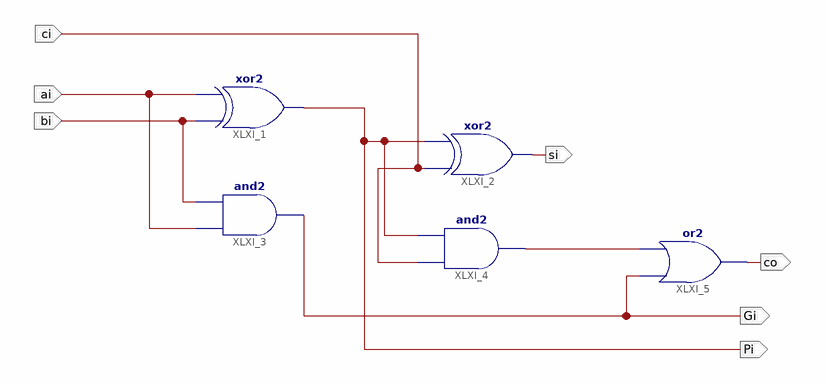
[diagram p0: schematic sheet 1]
// Xilinx ISE schematic Adder1.sch (kintex7) as structural Verilog: 5 symbols, 7 ports
module Adder1 (
  input  ai,
  input  bi,
  input  ci,
  output Pi,
  output Gi,
  output si,
  output co
);

  wire XLXN_11;

  xor XLXI_1 (Pi, bi, ai);
  xor XLXI_2 (si, ci, Pi);
  and XLXI_3 (Gi, ai, bi);
  and XLXI_4 (XLXN_11, ci, Pi);
  or XLXI_5 (co, Gi, XLXN_11);
endmodule
